# EAGLE design 5ChannelStepperDriver (EAGLE 6.3)
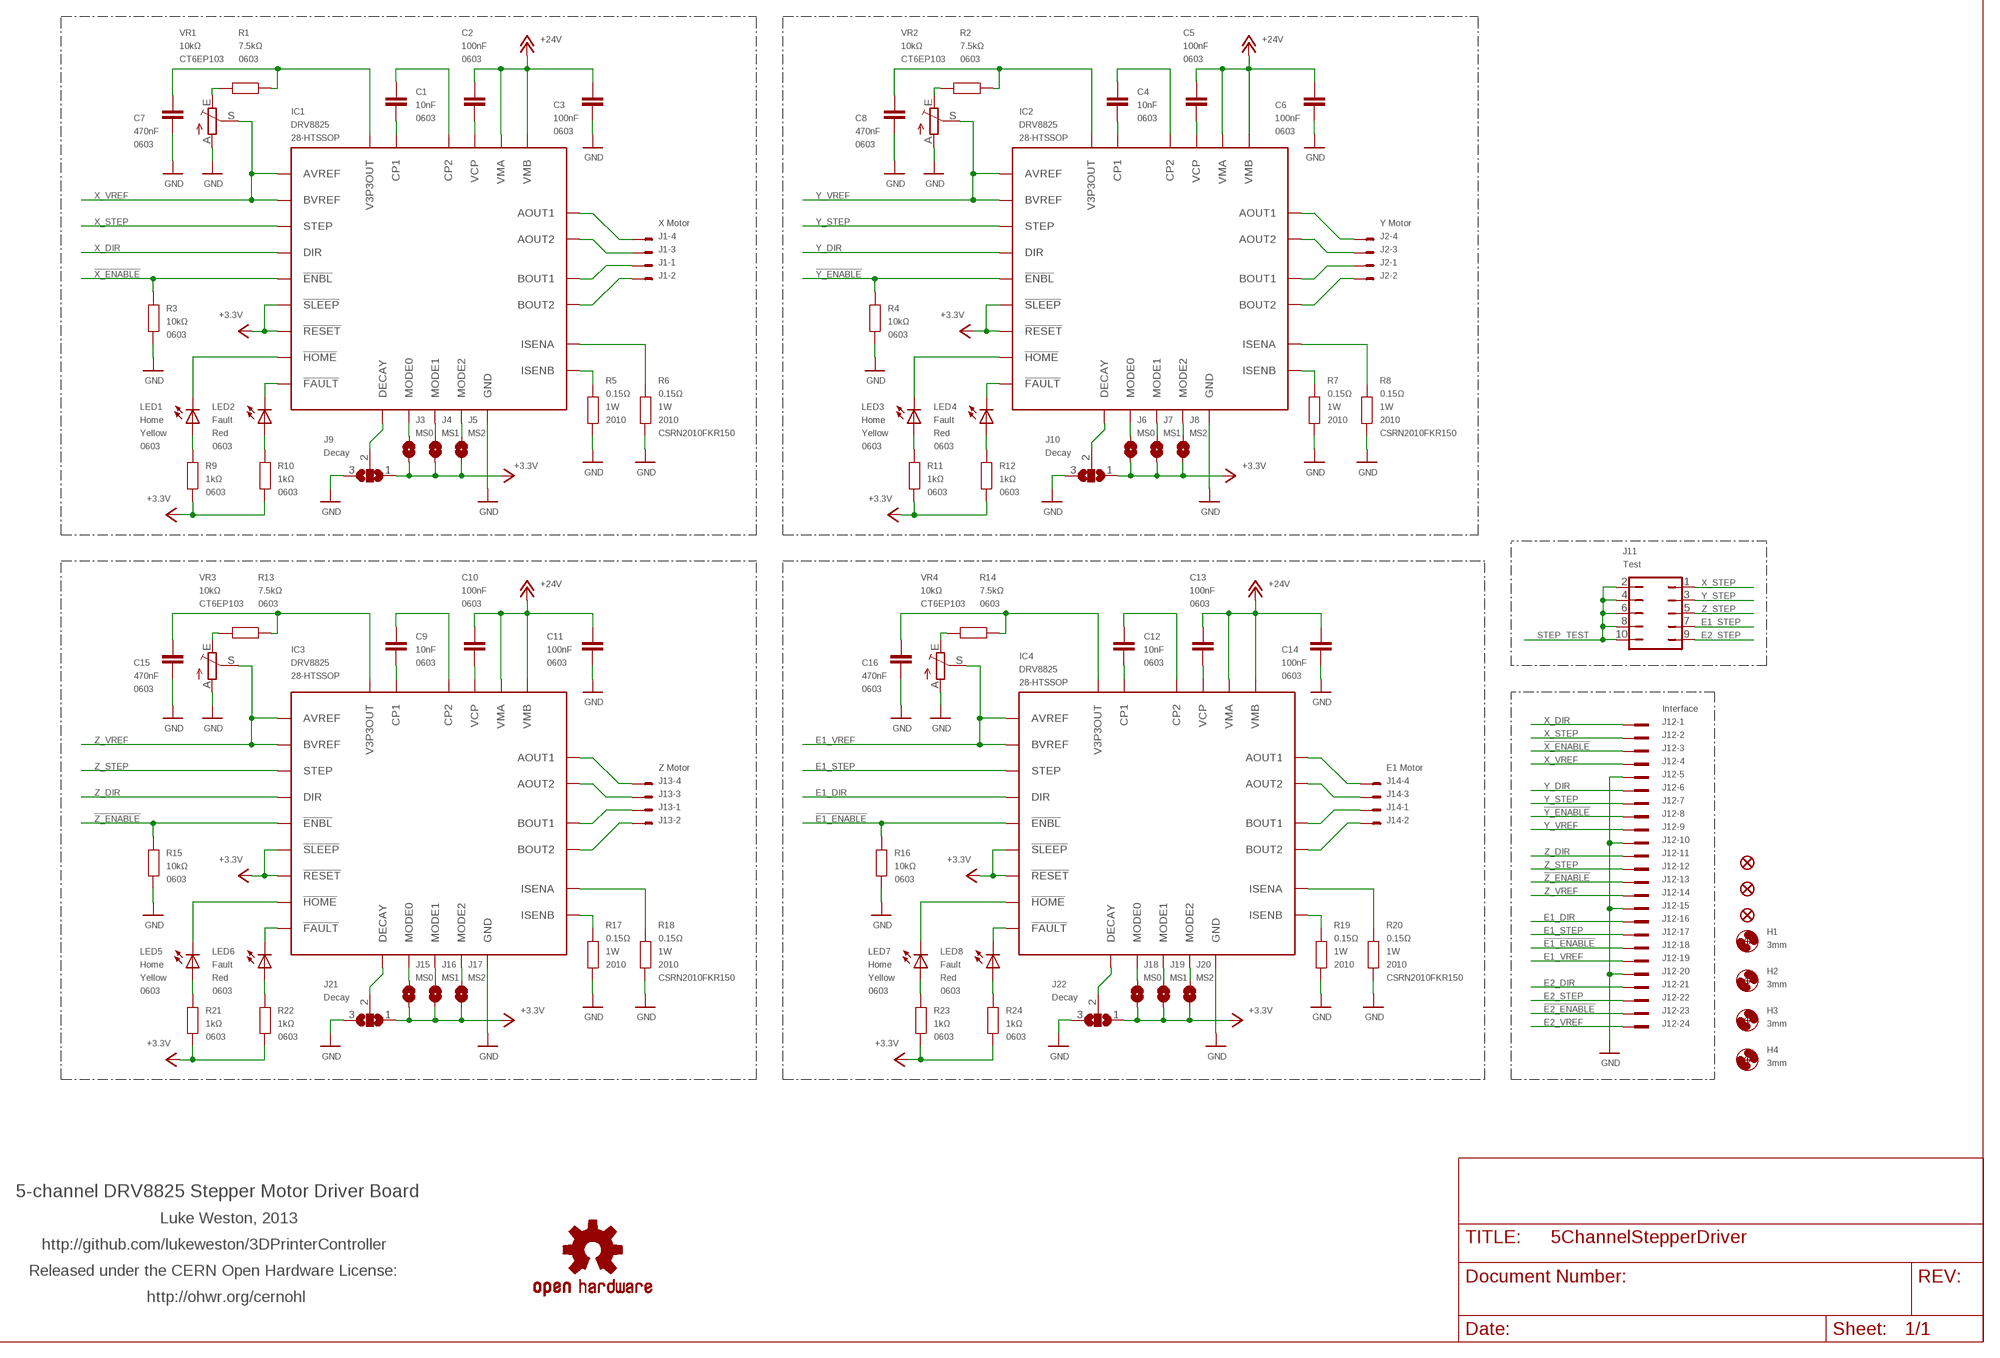
[diagram p0: schematic, sheet 1, part 1 of 3]
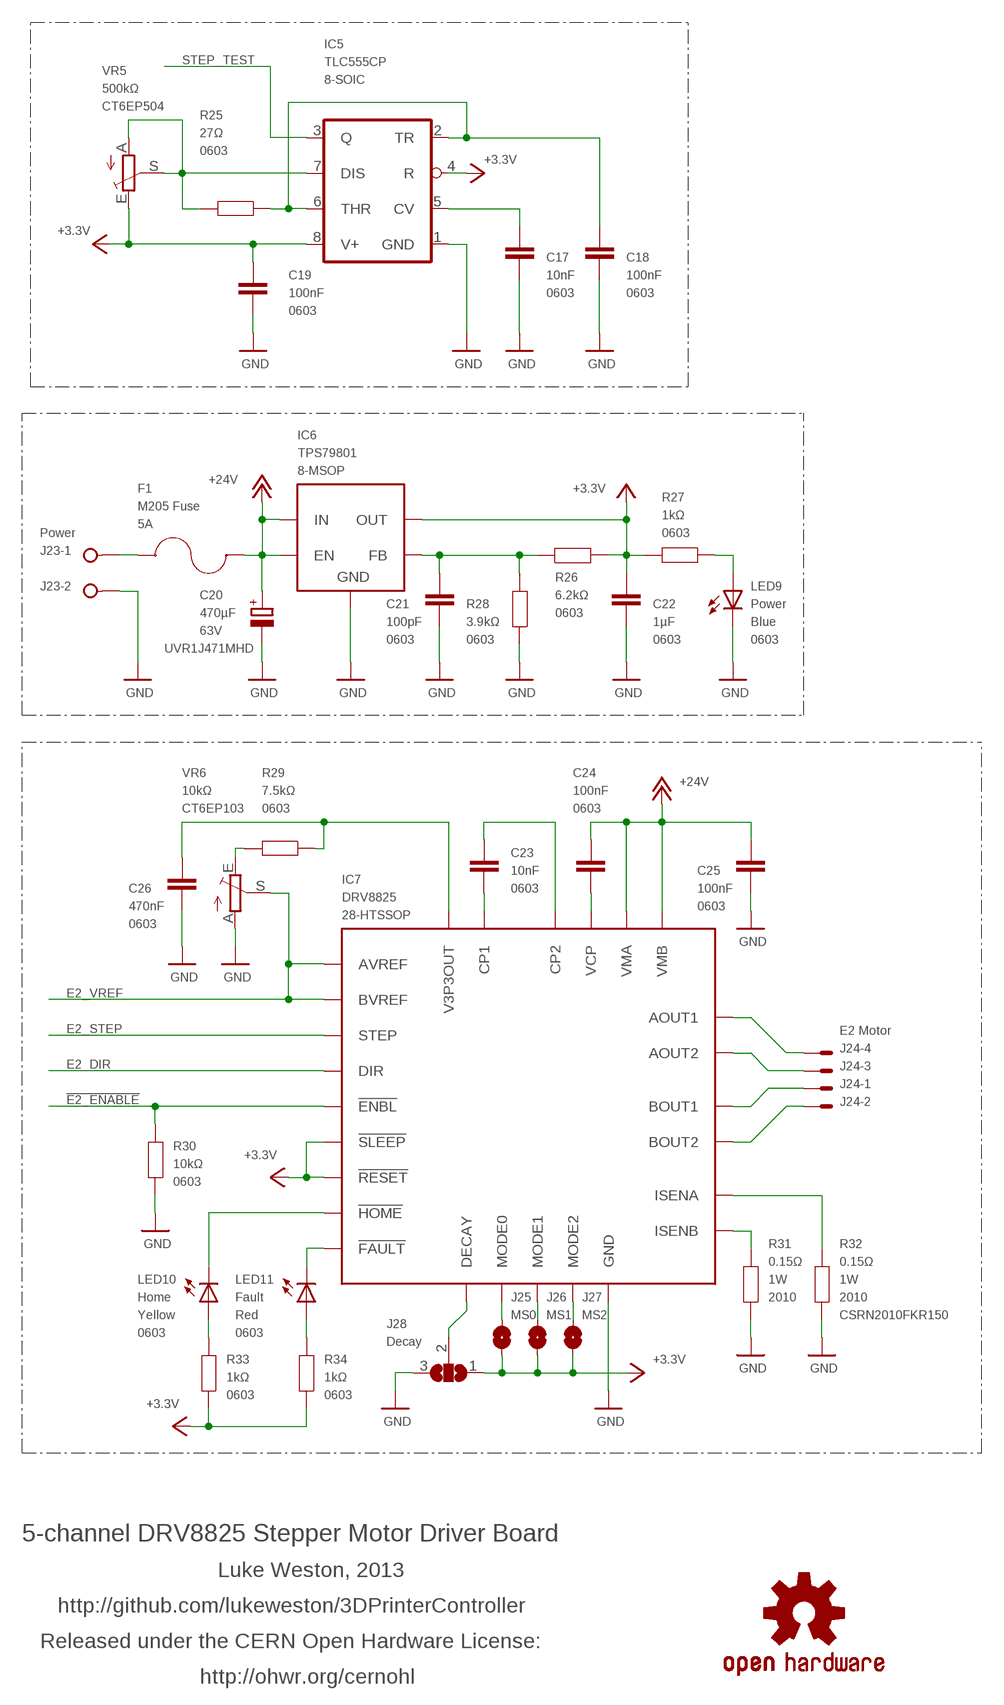
[diagram p1: schematic, sheet 1, part 2 of 3]
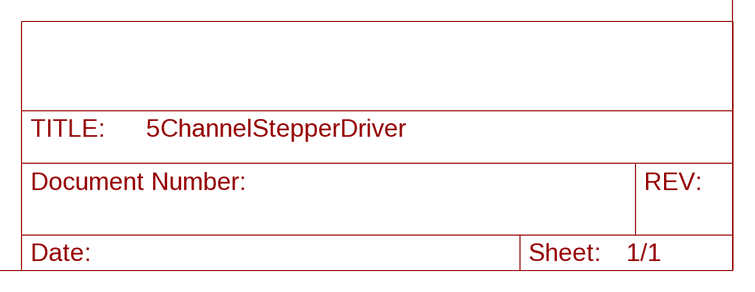
[diagram p2: schematic, sheet 1, part 3 of 3]

## Parts
C1  10nF  CAP0603  [0603]
C2  100nF  CAP0603  [0603]
C3  100nF  CAP0603  [0603]
C4  10nF  CAP0603  [0603]
C5  100nF  CAP0603  [0603]
C6  100nF  CAP0603  [0603]
C7  470nF  CAP0603  [0603]
C8  470nF  CAP0603  [0603]
C9  10nF  CAP0603  [0603]
C10  100nF  CAP0603  [0603]
C11  100nF  CAP0603  [0603]
C12  10nF  CAP0603  [0603]
C13  100nF  CAP0603  [0603]
C14  100nF  CAP0603  [0603]
C15  470nF  CAP0603  [0603]
C16  470nF  CAP0603  [0603]
C17  10nF  CAP0603  [0603]
C18  100nF  CAP0603  [0603]
C19  100nF  CAP0603  [0603]
C20  470µF  CPOL-EUE5-13  [E5-13]
C21  100pF  CAP0603  [0603]
C22  1µF  CAP0603  [0603]
C23  10nF  CAP0603  [0603]
C24  100nF  CAP0603  [0603]
C25  100nF  CAP0603  [0603]
C26  470nF  CAP0603  [0603]
F1  M205 Fuse  FUSE-M205  [FUSECLIP-FC211]
H1  3mm  MOUNT-HOLE3.0  [3,0]
H2  3mm  MOUNT-HOLE3.0  [3,0]
H3  3mm  MOUNT-HOLE3.0  [3,0]
H4  3mm  MOUNT-HOLE3.0  [3,0]
IC1  DRV8825  [R-PDSO-G28]
IC2  DRV8825  [R-PDSO-G28]
IC3  DRV8825  [R-PDSO-G28]
IC4  DRV8825  [R-PDSO-G28]
IC5  TLC555CP  LM555D  [SO08]
IC6  TPS79801  [R-PDSO-G8]
IC7  DRV8825  [R-PDSO-G28]
J1  X Motor  22-05-7048-04  [7395-04]
J2  Y Motor  22-05-7048-04  [7395-04]
J3  MS0  SJ  [SJ]
J4  MS1  SJ  [SJ]
J5  MS2  SJ  [SJ]
J6  MS0  SJ  [SJ]
J7  MS1  SJ  [SJ]
J8  MS2  SJ  [SJ]
J9  Decay  SJ2W  [SJ_2]
J10  Decay  SJ2W  [SJ_2]
J11  Test  JP5Q  [JP5Q]
J12  Interface  2524-  [PAK100/2500-24]
J13  Z Motor  22-05-7048-04  [7395-04]
J14  E1 Motor  22-05-7048-04  [7395-04]
J15  MS0  SJ  [SJ]
J16  MS1  SJ  [SJ]
J17  MS2  SJ  [SJ]
J18  MS0  SJ  [SJ]
J19  MS1  SJ  [SJ]
J20  MS2  SJ  [SJ]
J21  Decay  SJ2W  [SJ_2]
J22  Decay  SJ2W  [SJ_2]
J23  Power  W237-02P  [W237-132]
J24  E2 Motor  22-05-7048-04  [7395-04]
J25  MS0  SJ  [SJ]
J26  MS1  SJ  [SJ]
J27  MS2  SJ  [SJ]
J28  Decay  SJ2W  [SJ_2]
JP1  FIDUCIAL1X2  [FIDUCIAL-1X2]
JP2  FIDUCIAL1X2  [FIDUCIAL-1X2]
JP3  FIDUCIAL1X2  [FIDUCIAL-1X2]
LED1  Home  LED0603  [LED-0603]
LED2  Fault  LED0603  [LED-0603]
LED3  Home  LED0603  [LED-0603]
LED4  Fault  LED0603  [LED-0603]
LED5  Home  LED0603  [LED-0603]
LED6  Fault  LED0603  [LED-0603]
LED7  Home  LED0603  [LED-0603]
LED8  Fault  LED0603  [LED-0603]
LED9  Power  LED0603  [LED-0603]
LED10  Home  LED0603  [LED-0603]
LED11  Fault  LED0603  [LED-0603]
R1  7.5kΩ  RESISTOR0603  [0603]
R2  7.5kΩ  RESISTOR0603  [0603]
R3  10kΩ  RESISTOR0603  [0603]
R4  10kΩ  RESISTOR0603  [0603]
R5  0.15Ω  RESISTOR2010  [R2010]
R6  0.15Ω  RESISTOR2010  [R2010]
R7  0.15Ω  RESISTOR2010  [R2010]
R8  0.15Ω  RESISTOR2010  [R2010]
R9  1kΩ  RESISTOR0603  [0603]
R10  1kΩ  RESISTOR0603  [0603]
R11  1kΩ  RESISTOR0603  [0603]
R12  1kΩ  RESISTOR0603  [0603]
R13  7.5kΩ  RESISTOR0603  [0603]
R14  7.5kΩ  RESISTOR0603  [0603]
R15  10kΩ  RESISTOR0603  [0603]
R16  10kΩ  RESISTOR0603  [0603]
R17  0.15Ω  RESISTOR2010  [R2010]
R18  0.15Ω  RESISTOR2010  [R2010]
R19  0.15Ω  RESISTOR2010  [R2010]
R20  0.15Ω  RESISTOR2010  [R2010]
R21  1kΩ  RESISTOR0603  [0603]
R22  1kΩ  RESISTOR0603  [0603]
R23  1kΩ  RESISTOR0603  [0603]
R24  1kΩ  RESISTOR0603  [0603]
R25  27Ω  RESISTOR0603  [0603]
R26  6.2kΩ  RESISTOR0603  [0603]
R27  1kΩ  RESISTOR0603  [0603]
R28  3.9kΩ  RESISTOR0603  [0603]
R29  7.5kΩ  RESISTOR0603  [0603]
R30  10kΩ  RESISTOR0603  [0603]
R31  0.15Ω  RESISTOR2010  [R2010]
R32  0.15Ω  RESISTOR2010  [R2010]
R33  1kΩ  RESISTOR0603  [0603]
R34  1kΩ  RESISTOR0603  [0603]
SY1  OSHW-LOGOS  [OSHW-LOGO-S]
SY2  OSHW-LOGOS  [OSHW-LOGO-S]
VR1  10kΩ  TRIM_EU-CT6  [CT6]
VR2  10kΩ  TRIM_EU-CT6  [CT6]
VR3  10kΩ  TRIM_EU-CT6  [CT6]
VR4  10kΩ  TRIM_EU-CT6  [CT6]
VR5  500kΩ  TRIM_EU-CT6  [CT6]
VR6  10kΩ  TRIM_EU-CT6  [CT6]

## Nets
!E1_ENABLE: IC4.21(!ENBL) J12.18 R16.1
!E2_ENABLE: IC7.21(!ENBL) J12.23 R30.1
!X_ENABLE: IC1.21(!ENBL) J12.3 R3.1
!Y_ENABLE: IC2.21(!ENBL) J12.8 R4.1
!Z_ENABLE: IC3.21(!ENBL) J12.13 R15.1
+3V3: C19.1 C22.1 IC1.16(!RESET) IC1.17(!SLEEP) IC2.16(!RESET) IC2.17(!SLEEP) IC3.16(!RESET) IC3.17(!SLEEP) IC4.16(!RESET) IC4.17(!SLEEP) IC5.4(R) IC5.8(V+) IC6.1(OUT) IC7.16(!RESET) IC7.17(!SLEEP) J3.1 J4.1 J5.1 J6.1 J7.1 J8.1 J9.1 J10.1 J15.1 J16.1 J17.1 J18.1 J19.1 J20.1 J21.1 J22.1 J25.1 J26.1 J27.1 J28.1 R9.2 R10.2 R11.2 R12.2 R21.2 R22.2 R23.2 R24.2 R26.2 R27.2 R33.2 R34.2 VR5.E ; supply symbol labelled +3.3V
+24V: C2.1 C3.1 C5.1 C6.1 C10.1 C11.1 C13.1 C14.1 C20.+ C24.1 C25.1 F1.3 F1.4 IC1.4(VMA) IC1.11(VMB) IC2.4(VMA) IC2.11(VMB) IC3.4(VMA) IC3.11(VMB) IC4.4(VMA) IC4.11(VMB) IC6.5(EN) IC6.8(IN) IC7.4(VMA) IC7.11(VMB)
E1_DIR: IC4.20(DIR) J12.16
E1_STEP: IC4.22(STEP) J11.7 J12.17
E1_VREF: IC4.12(AVREF) IC4.13(BVREF) J12.19 VR4.S
E2_DIR: IC7.20(DIR) J12.21
E2_STEP: IC7.22(STEP) J11.9 J12.22
E2_VREF: IC7.12(AVREF) IC7.13(BVREF) J12.24 VR6.S
GND: C3.2 C6.2 C7.2 C8.2 C11.2 C14.2 C15.2 C16.2 C17.2 C18.2 C19.2 C20.- C21.2 C22.2 C25.2 C26.2 IC1.14(GND) IC1.28(GND) IC1.PAD(GND) IC2.14(GND) IC2.28(GND) IC2.PAD(GND) IC3.14(GND) IC3.28(GND) IC3.PAD(GND) IC4.14(GND) IC4.28(GND) IC4.PAD(GND) IC5.1(GND) IC6.4(GND) IC6.PAD(GND) IC7.14(GND) IC7.28(GND) IC7.PAD(GND) J9.3 J10.3 J12.5 J12.10 J12.15 J12.20 J21.3 J22.3 J23.2 J28.3 LED9.C R3.2 R4.2 R5.2 R6.2 R7.2 R8.2 R15.2 R16.2 R17.2 R18.2 R19.2 R20.2 R28.2 R30.2 R31.2 R32.2 VR1.A VR2.A VR3.A VR4.A VR6.A
N$3: IC1.5(AOUT1) J1.4
N$5: IC4.10(BOUT1) J14.1
N$6: IC3.10(BOUT1) J13.1
N$7: IC7.10(BOUT1) J24.1
N$8: IC7.7(AOUT2) J24.3
N$9: C7.1 IC1.15(V3P3OUT) R1.1
N$10: F1.1 F1.2 J23.1
N$11: R14.2 VR4.E
N$12: C8.1 IC2.15(V3P3OUT) R2.1
N$13: C16.1 IC4.15(V3P3OUT) R14.1
N$14: C26.1 IC7.15(V3P3OUT) R29.1
N$16: R2.2 VR2.E
N$17: R29.2 VR6.E
N$18: R1.2 VR1.E
N$19: C18.1 IC5.2(TR) IC5.6(THR) R25.1
N$20: C15.1 IC3.15(V3P3OUT) R13.1
N$21: C21.1 IC6.2(FB) R26.1 R28.1
N$22: R13.2 VR3.E
N$23: C17.1 IC5.5(CV)
N$24: LED9.A R27.1
N$26: IC5.7(DIS) R25.2 VR5.A VR5.S
N$28: IC1.7(AOUT2) J1.3
N$29: IC1.10(BOUT1) J1.1
N$35: IC1.8(BOUT2) J1.2
N$36: C1.2 IC1.1(CP1)
N$52: C1.1 IC1.2(CP2)
N$54: IC1.19(DECAY) J9.2
N$57: C2.2 IC1.3(VCP)
N$59: IC1.6(ISENA) R6.1
N$60: IC3.5(AOUT1) J13.4
N$61: IC1.9(ISENB) R5.1
N$62: IC3.7(AOUT2) J13.3
N$65: IC3.8(BOUT2) J13.2
N$67: IC1.18(!FAULT) LED2.C
N$68: IC1.27(!HOME) LED1.C
N$69: LED1.A R9.1
N$70: LED2.A R10.1
N$71: IC1.25(MODE1) J4.2
N$72: IC1.26(MODE2) J5.2
N$73: IC1.24(MODE0) J3.2
N$74: C10.2 IC3.3(VCP)
N$75: IC3.6(ISENA) R18.1
N$76: IC3.9(ISENB) R17.1
N$78: IC3.18(!FAULT) LED6.C
N$79: IC3.27(!HOME) LED5.C
N$80: LED5.A R21.1
N$81: LED6.A R22.1
N$82: C9.2 IC3.1(CP1)
N$83: C9.1 IC3.2(CP2)
N$84: IC3.19(DECAY) J21.2
N$85: IC3.24(MODE0) J15.2
N$86: IC3.25(MODE1) J16.2
N$87: IC3.26(MODE2) J17.2
N$91: IC2.5(AOUT1) J2.4
N$92: IC2.7(AOUT2) J2.3
N$93: IC2.10(BOUT1) J2.1
N$94: IC2.8(BOUT2) J2.2
N$95: C5.2 IC2.3(VCP)
N$96: IC2.6(ISENA) R8.1
N$97: IC2.9(ISENB) R7.1
N$99: IC2.18(!FAULT) LED4.C
N$100: IC2.27(!HOME) LED3.C
N$101: LED3.A R11.1
N$102: LED4.A R12.1
N$105: C4.2 IC2.1(CP1)
N$106: C4.1 IC2.2(CP2)
N$107: IC2.19(DECAY) J10.2
N$108: IC2.24(MODE0) J6.2
N$109: IC2.25(MODE1) J7.2
N$110: IC2.26(MODE2) J8.2
N$111: IC4.5(AOUT1) J14.4
N$112: IC4.7(AOUT2) J14.3
N$114: IC4.8(BOUT2) J14.2
N$115: C13.2 IC4.3(VCP)
N$116: IC4.6(ISENA) R20.1
N$117: IC4.9(ISENB) R19.1
N$119: IC4.18(!FAULT) LED8.C
N$120: IC4.27(!HOME) LED7.C
N$121: LED7.A R23.1
N$122: LED8.A R24.1
N$123: C12.2 IC4.1(CP1)
N$124: C12.1 IC4.2(CP2)
N$125: IC4.19(DECAY) J22.2
N$126: IC4.24(MODE0) J18.2
N$127: IC4.25(MODE1) J19.2
N$128: IC4.26(MODE2) J20.2
N$165: IC7.5(AOUT1) J24.4
N$168: IC7.8(BOUT2) J24.2
N$169: C24.2 IC7.3(VCP)
N$170: IC7.6(ISENA) R32.1
N$171: IC7.9(ISENB) R31.1
N$173: IC7.18(!FAULT) LED11.C
N$174: IC7.27(!HOME) LED10.C
N$175: LED10.A R33.1
N$176: LED11.A R34.1
N$177: C23.2 IC7.1(CP1)
N$178: C23.1 IC7.2(CP2)
N$179: IC7.19(DECAY) J28.2
N$180: IC7.24(MODE0) J25.2
N$181: IC7.25(MODE1) J26.2
N$182: IC7.26(MODE2) J27.2
STEP_TEST: IC5.3(Q) J11.2 J11.4 J11.6 J11.8 J11.10
X_DIR: IC1.20(DIR) J12.1
X_STEP: IC1.22(STEP) J11.1 J12.2
X_VREF: IC1.12(AVREF) IC1.13(BVREF) J12.4 VR1.S
Y_DIR: IC2.20(DIR) J12.6
Y_STEP: IC2.22(STEP) J11.3 J12.7
Y_VREF: IC2.12(AVREF) IC2.13(BVREF) J12.9 VR2.S
Z_DIR: IC3.20(DIR) J12.11
Z_STEP: IC3.22(STEP) J11.5 J12.12
Z_VREF: IC3.12(AVREF) IC3.13(BVREF) J12.14 VR3.S

## Notes on the sheet
- 5-channel DRV8825 Stepper Motor Driver Board
- Luke Weston, 2013
- http://github.com/lukeweston/3DPrinterController
- Released under the CERN Open Hardware License:
- http://ohwr.org/cernohl
- 5-channel DRV8825 Stepper Motor Driver Board
- Luke Weston, 2013
- http://github.com/lukeweston/3DPrinterController
- Released under the CERN Open Hardware License:
- http://ohwr.org/cernohl

## Library data of the parts
C1-C19 C21-C26 = freetronics-master-v1:CAP: Capacitor Standard 0603 ceramic capacitor, and 0.1" leaded capacitor.; PACKAGE: 0603
C20 = rcl:CPOL-EU: POLARIZED CAPACITOR, European symbol; SKU: UVR1J471MHD; VOLTAGE: 63V
F1 = freetronics-luke:FUSE-M205: PC-mount M205 fuse clips; VALUE2: 5A
H1-H4 = holes:MOUNT-HOLE: MOUNTING HOLE with drill center marker
IC1-IC4 IC7 = freetronics-luke:DRV8825: Texas Instruments DRV8825 bipolar stepper motor driver; PACKAGE: 28-HTSSOP
IC5 = linear:*555: TIMER; PACKAGE: 8-SOIC
IC6 = freetronics-luke:TPS79801: TI TPS79801 high-Vin, 50mA LDO; PACKAGE: 8-MSOP
J1 J2 J13 J14 J24 = con-molex:22-?-04: CONNECTOR wire to board 2.54 mm (.1 inch) pitch header; OC_FARNELL: unknown; OC_NEWARK: unknown
J3-J8 J15-J20 J25-J27 = freetronics-luke:SJ: PCB "solder jumper". Note that there should nothing on the BOM corresponding to this "component".
J9 J10 J21 J22 J28 = freetronics-master-v1:SJ2W: SMD solder JUMPER
J11 = jumper:JP5Q: JUMPER
J12 = con-3m:2524-: 3M (TM) Pak 100 4-Wall Header Source: 3M; OC_FARNELL: unknown; OC_NEWARK: unknown
J23 = con-wago-508:W237-02P: WAGO SREW CLAMP; OC_FARNELL: unknown; OC_NEWARK: unknown
JP1-JP3 = SparkFun:FIDUCIAL: Fiducial Alignment Points Various fiducial points for machine vision alignment.
LED1 LED3 LED5 LED7 LED10 = freetronics-master-v1:LED: LEDs Standard schematic elements and footprints for 5mm, 3mm, 1206, and 0603 sized LEDs. 5mm - Spark Fun Electronics SKU : COM-00529 (and others); COLOR: Yellow; PACKAGE: 0603
LED2 LED4 LED6 LED8 LED11 = freetronics-master-v1:LED: LEDs Standard schematic elements and footprints for 5mm, 3mm, 1206, and 0603 sized LEDs. 5mm - Spark Fun Electronics SKU : COM-00529 (and others); COLOR: Red; PACKAGE: 0603
LED9 = freetronics-master-v1:LED: LEDs Standard schematic elements and footprints for 5mm, 3mm, 1206, and 0603 sized LEDs. 5mm - Spark Fun Electronics SKU : COM-00529 (and others); COLOR: Blue; PACKAGE: 0603
R1-R4 R9-R16 R21-R30 R33 R34 = freetronics-master-v1:RESISTOR: Resistor Basic schematic elements and footprints for 0603, 1206, and PTH 1/10th watt (small) resistors.; PACKAGE: 0603
R5-R8 R17-R20 R31 R32 = freetronics-master-v1:RESISTOR: Resistor Basic schematic elements and footprints for 0603, 1206, and PTH 1/10th watt (small) resistors.; ID: CSRN2010FKR150; PACKAGE: 2010; POWER: 1W
SY1 SY2 = SparkFun:OSHW-LOGO: Open Source Hardware Logo This logo indicates the piece of hardware it is found on incorporates a OSHW license and/or adheres to the definition of open source hardware found here: http://freedomdefined.org/OSHW
VR1-VR4 VR6 = pot:TRIM_EU-: POTENTIOMETER; ID: CT6EP103
VR5 = pot:TRIM_EU-: POTENTIOMETER; ID: CT6EP504

## Board
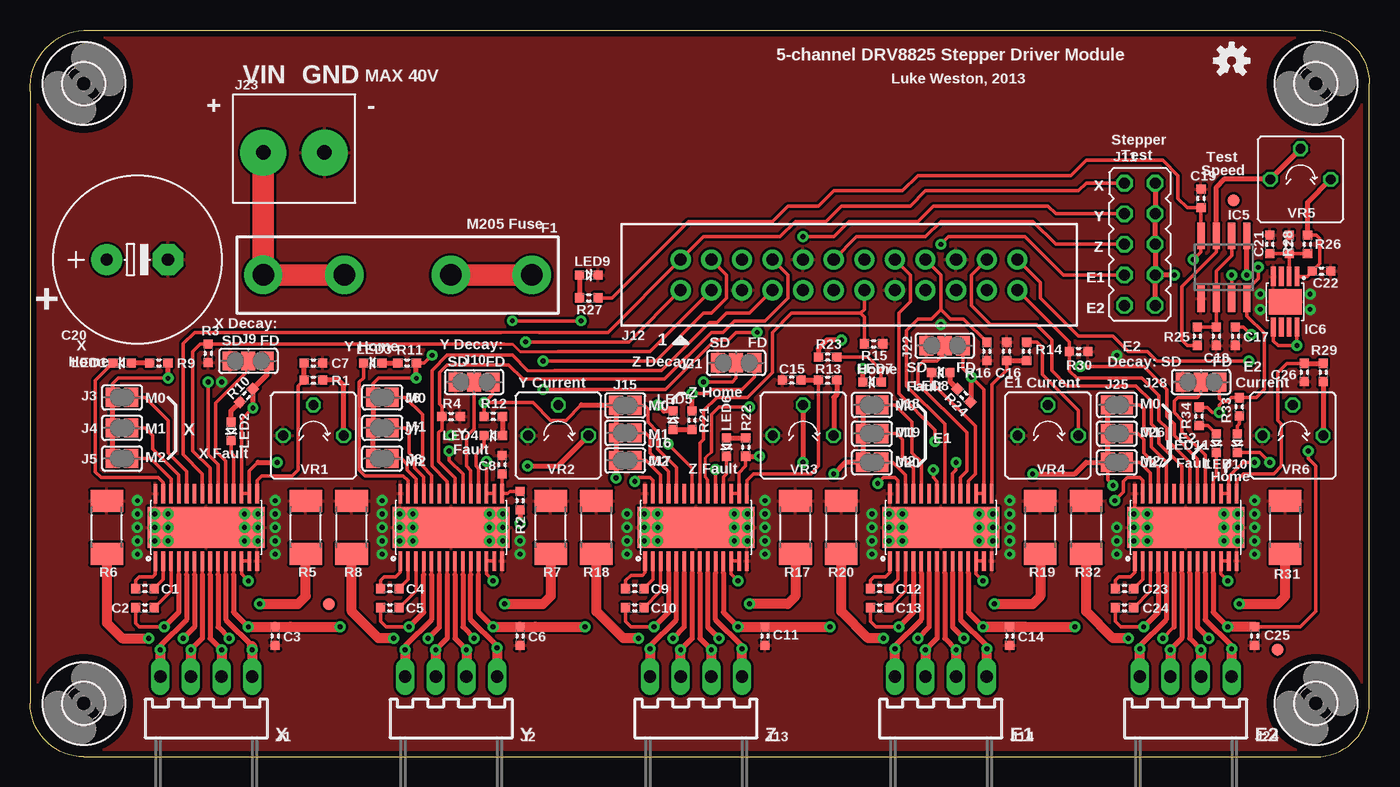
[diagram p3: board, top side]
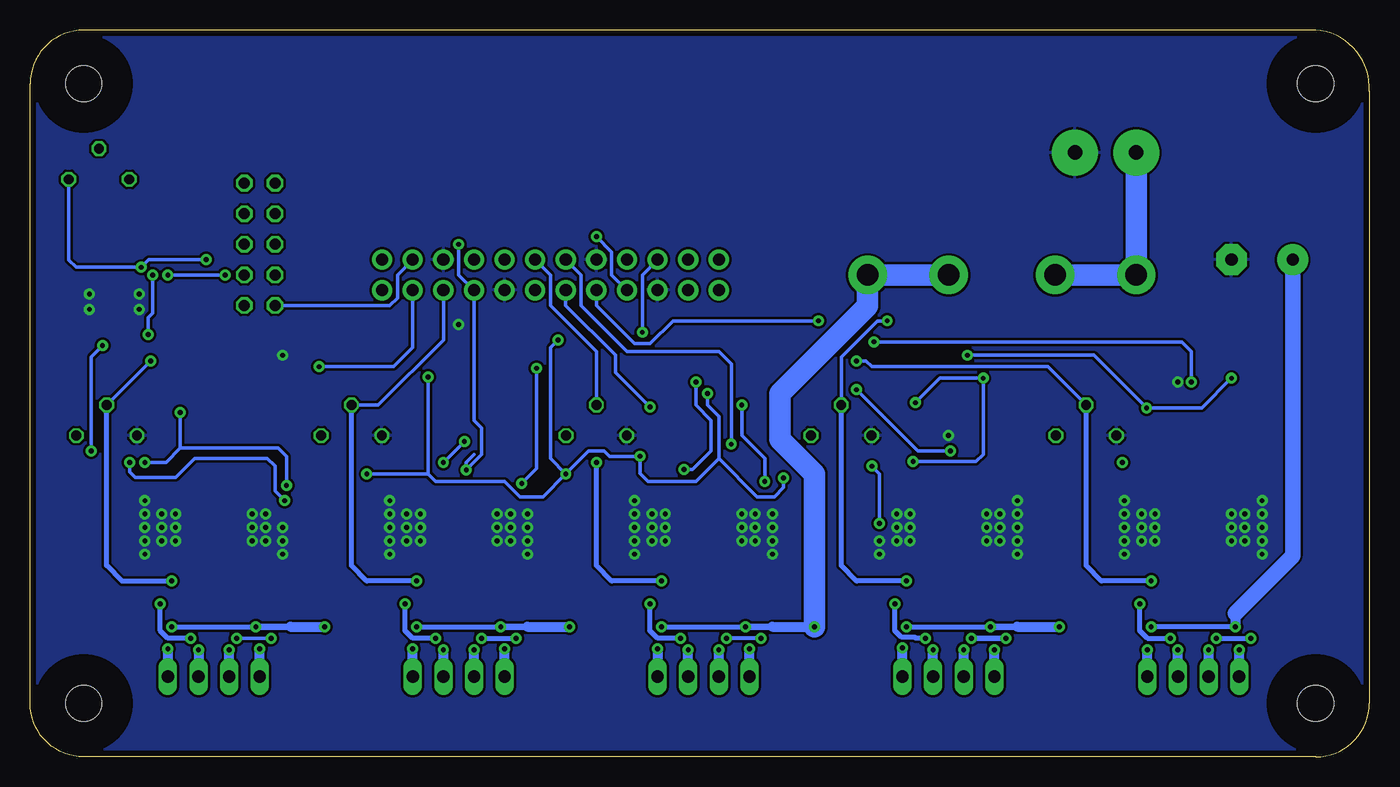
[diagram p4: board, bottom side, seen from below]

Size 111.13 x 60.32 mm. Coordinates in mm from the lower left corner, seen from the top.
Outline: 4.45,0 106.69,0 arc90 111.13,4.45 111.13,55.88 arc90 106.69,60.32 4.45,60.32 arc90 0.01,55.24 0.01,4.45 arc90 4.45,0
Copper layers (1*16): Top 0.035mm / dielectric 1.5mm / Bottom 0.035mm
Design rules "PCBCart-Standard *": minimum track width 8mil, minimum drill 0.4mm, track to track 8mil, track to pad 8mil, pad to pad 8mil, via to via 8mil, smd to smd 8mil, copper to edge 20mil, drill to drill 8mil, minimum pad ring 8mil, minimum via ring 10mil, stop-mask expansion 3mil, vias tented up to drill 16mil, thermal gap 8mil

### Footprints (pad centres in the part's own frame; a part is rotated, then mirrored left to right if it is on the bottom)
0603 = smd 0.762 x 0.762: 1 -0.762,0; 2 0.762,0
E5-13 = drill 1.016 pad 2.54: + -2.54,0 | drill 1.016 pad 2.54 octagon: - 2.54,0
FUSECLIP-FC211 = drill 1.778 pad 3.175: 1 -11.143,0; 2 -4.412,0; 3 4.412,0; 4 11.143,0
3,0 = hole 3: 0,0
R-PDSO-G28 = smd 0.3 x 1.6: 1 -4.225,-2.8; 2 -3.575,-2.8; 3 -2.925,-2.8; 4 -2.275,-2.8; 5 -1.625,-2.8; 6 -0.975,-2.8; 7 -0.325,-2.8; 8 0.325,-2.8; 9 0.975,-2.8; 10 1.625,-2.8; 11 2.275,-2.8; 12 2.925,-2.8; 13 3.575,-2.8; 14 4.225,-2.8; 15 4.225,2.8; 16 3.575,2.8; 17 2.925,2.8; 18 2.275,2.8; 19 1.625,2.8; 20 0.975,2.8; 21 0.325,2.8; 22 -0.325,2.8; 23 -0.975,2.8; 24 -1.625,2.8; 25 -2.275,2.8; 26 -2.925,2.8; 27 -3.575,2.8; 28 -4.225,2.8 | smd 9.7 x 3.4: PAD 0,0
SO08 = smd 0.6 x 2.2: 1 -1.905,-2.6; 2 -0.635,-2.6; 3 0.635,-2.6; 4 1.905,-2.6; 5 1.905,2.6; 6 0.635,2.6; 7 -0.635,2.6; 8 -1.905,2.6
R-PDSO-G8 = smd 0.4 x 1.6: 1 -0.975,-2.1; 2 -0.325,-2.1; 3 0.325,-2.1; 4 0.975,-2.1; 5 0.975,2.1; 6 0.325,2.1; 7 -0.325,2.1; 8 -0.975,2.1 | smd 2.75 x 2.1: PAD 0,0
7395-04 = drill 1.016 long: 1 3.81,0; 2 1.27,0; 3 -1.27,0; 4 -3.81,0
SJ = smd 1.168 x 1.6: 1 -0.762,0; 2 0.762,0
SJ_2 = smd 1.168 x 1.6: 1 -1.524,0; 2 0,0; 3 1.524,0
JP5Q = drill 0.914 octagon: 1 -5.08,-1.27; 2 -5.08,1.27; 3 -2.54,-1.27; 4 -2.54,1.27; 5 0,-1.27; 6 0,1.27; 7 2.54,-1.27; 8 2.54,1.27; 9 5.08,-1.27; 10 5.08,1.27
PAK100/2500-24 = drill 1 pad 1.676: 1 -13.97,-1.27; 2 -13.97,1.27; 3 -11.43,-1.27; 4 -11.43,1.27; 5 -8.89,-1.27; 6 -8.89,1.27; 7 -6.35,-1.27; 8 -6.35,1.27; 9 -3.81,-1.27; 10 -3.81,1.27; 11 -1.27,-1.27; 12 -1.27,1.27; 13 1.27,-1.27; 14 1.27,1.27; 15 3.81,-1.27; 16 3.81,1.27; 17 6.35,-1.27; 18 6.35,1.27; 19 8.89,-1.27; 20 8.89,1.27; 21 11.43,-1.27; 22 11.43,1.27; 23 13.97,-1.27; 24 13.97,1.27
W237-132 = drill 1.194 pad 3.81: 1 -2.54,-0.635; 2 2.54,-0.635
FIDUCIAL-1X2 = smd 1 x 1: 1 0,0
LED-0603 = smd 0.762 x 0.762: A -0.762,0; C 0.762,0
R2010 = smd 1.8 x 2.7: 1 -2.2,0; 2 2.2,0
CT6 = drill 0.813 octagon: A -2.515,0; E 2.515,0; S 0,2.54

### Placement (x,y rotation side)
C1  9.53,13.97 180 top
C2  9.53,12.38 0 top
C3  20.33,10.03 270 top
C4  29.85,13.97 180 top
C5  29.85,12.38 0 top
C6  40.65,10.03 270 top
C7  23.5,32.7 0 top
C8  39.16,24.26 90 top
C9  50.17,13.97 180 top
C10  50.17,12.38 0 top
C11  60.97,10.03 270 top
C12  70.49,13.97 180 top
C13  70.49,12.38 0 top
C14  81.29,10.03 270 top
C15  63.19,31.27 180 top
C16  81.03,33.66 90 top
C17  100.02,34.92 270 top
C18  98.43,34.92 270 top
C19  97.16,46.35 90 top
C20  8.9,41.27 0 top
C21  102.88,42.54 90 top
C22  107.17,40.32 0 top
C23  90.81,13.97 180 top
C24  90.81,12.38 0 top
C25  101.61,10.03 270 top
C26  105.74,31.91 270 top
F1  30.49,40 0 top
H1  106.69,55.88 0 top
H2  4.45,55.88 0 top
H3  106.69,4.45 0 top
H4  4.45,4.45 0 top
IC1  14.61,19.05 0 top
IC2  34.93,19.05 0 top
IC3  55.25,19.05 0 top
IC4  75.57,19.05 0 top
IC5  99.07,40.64 0 top
IC6  104.15,37.78 180 top
IC7  95.89,19.05 0 top
J1  14.61,6.67 0 top
J2  34.93,6.67 0 top
J3  7.63,29.85 0 top
J4  7.63,27.31 0 top
J5  7.63,24.77 0 top
J6  29.22,29.85 0 top
J7  29.22,27.31 0 top
J8  29.22,24.77 0 top
J9  18.11,32.86 180 top
J10  36.84,31.12 180 top
J11  92.08,42.54 270 top
J12  67.95,40 0 top
J13  55.25,6.67 0 top
J14  75.57,6.67 0 top
J15  49.38,29.18 0 top
J16  49.38,26.89 0 top
J17  49.38,24.61 0 top
J18  69.86,29.21 0 top
J19  69.86,26.83 0 top
J20  69.86,24.45 0 top
J21  58.59,32.7 180 top
J22  75.89,34.13 180 top
J23  21.89,50.8 0 top
J24  95.89,6.67 0 top
J25  90.18,29.21 0 top
J26  90.18,26.83 0 top
J27  90.18,24.45 0 top
J28  97.16,31.12 180 top
JP1  103.51,8.89 0 top
JP2  99.86,46.2 0 top
JP3  24.77,12.7 0 top
LED1  7.63,32.7 180 top
LED2  16.68,27.02 270 top
LED3  28.43,32.7 180 top
LED4  38.43,26.67 180 top
LED5  53.35,27.94 90 top
LED6  57.79,25.72 270 top
LED7  69.86,31.12 180 top
LED8  75.57,31.91 180 top
LED9  46.36,40 0 top
LED10  100.18,26.04 270 top
LED11  98.43,26.04 270 top
R1  23.5,31.27 0 top
R2  40.65,21.27 270 top
R3  14.77,33.5 270 top
R4  34.93,28.26 0 top
R5  22.87,19.05 90 top
R6  6.36,19.05 90 top
R7  43.19,19.05 90 top
R8  26.68,19.05 90 top
R9  10.68,32.7 0 top
R10  17.95,30 45 top
R11  31.28,32.7 0 top
R12  38.43,28.26 180 top
R13  66.18,31.27 0 top
R14  82.69,33.66 90 top
R15  69.99,34.29 0 top
R16  79.38,33.66 270 top
R17  63.51,19.05 90 top
R18  47,19.05 90 top
R19  83.83,19.05 90 top
R20  67.32,19.05 90 top
R21  54.94,27.94 90 top
R22  59.38,25.72 270 top
R23  66.18,33.18 180 top
R24  77.48,30 315 top
R25  96.85,34.92 270 top
R26  106,42.54 90 top
R27  46.36,38.1 0 top
R28  104.48,42.54 90 top
R29  107.3,31.91 270 top
R30  87,33.66 0 top
R31  104.15,19.05 90 top
R32  87.64,19.05 90 top
R33  100.34,29.05 90 top
R34  97.01,28.26 90 top
SY1  99.7,57.78 0 top
SY2  99.7,57.78 0 top
VR1  23.5,26.67 0 top
VR2  43.82,26.67 0 top
VR3  64.14,26.67 0 top
VR4  84.46,26.67 0 top
VR5  105.42,47.94 0 top
VR6  104.78,26.67 0 top

### Tracks (layer width: path | path; a pad name or v marks a point on that pad's centre or on a via)
!E1_ENABLE
  Top 0.279: IC4.21 75.9,27.62 72.72,30.8 72.72,35.4 73.67,36.35 74.78,36.35 75.57,37.15 | 75.57,37.15 75.57,40 J12.18 | R16.1 77.45,36.35 76.37,36.35 75.57,37.15
!E2_ENABLE
  Top 0.279: IC7.21 96.22,24.44 94.31,26.35 94.31,27.31 93.67,27.94 93.67,30 92.24,31.43 86.84,31.43 86.24,32.04 R30.1 86.24,34.42 J12.23
!X_ENABLE
  Top 0.254: 43.82,33.66 40.65,33.66 40.05,34.26 39.35,34.26
  Top 0.279: 13.5,27.91 13.5,33.66 14.11,34.26 R3.1
  Top 0.305: IC1.21 14.94,23.96 13.5,25.4 13.5,27.91 | J12.3 51.44,33.66 43.82,33.66 | R3.1 39.35,34.26
!Y_ENABLE
  Top 0.279: 40.89,31.35 39.7,32.54 34.62,32.54 33.98,31.91 33.98,29.27 34.17,29.08 R4.1 34.17,27.18 33.9,26.91 33.9,24.53
  Top 0.305: IC2.21 35.26,23.17 33.9,24.53 | 40.89,31.35 52.63,31.35 56.52,35.24 57.48,35.24 58.43,36.2 60.97,36.2 62.87,38.1 62.87,40 J12.8
!Z_ENABLE
  Top 0.279: IC3.21 55.58,26.04 55.89,26.35 55.89,28.73 57,29.85 59.54,29.85 61.6,31.91 61.6,35.24 63.19,36.83 68.91,36.83 | R15.1 69.22,36.51 68.91,36.83 | J12.13 69.22,37.15 68.91,36.83
+3V3  (via drill 0.4)
  Top 0.279: J3.1 6.87,30.99 7.31,31.43 v11.44,31.43 | v18.49,28.96 17.54,28.01 IC1.17 IC1.16 18.19,23.74 18.9,24.45 | J6.1 28.46,30.99 28.9,31.43 v32.04,31.43 | IC2.17 v37.86,24.52 | J10.1 38.36,30.1 v37.66,29.4 | R11.2 32.71,32.7 v33.35,33.34 | IC6.1 105.96,39.88 C22.1 107.01,40.93 107.01,43.02 106.72,43.31 R26.2 | v37.66,29.4 41.73,29.4 43.19,27.94 44.46,27.94 45.73,29.21 | 48.59,29.21 J15.1 | R12.2 v37.66,29.4 | J21.1 60.11,31.53 59.06,30.48 56.52,30.48 56.21,30.16 v54.94,30.16 | IC3.16 58.83,23.58 59.38,24.13 R22.2 | J22.1 77.41,32.23 v78.11,31.53 79.15,30.49 IC4.16 | R24.2 | R24.2 78.11,29.37 | IC7.17 IC7.16 99.47,23.26 100.66,24.45 v101.61,24.45 | v89.86,22.54 89.42,22.99 J27.1 | R34.2 97.67,29.02 98.12,28.58 v98.69,28.58 98.69,29.21 98.96,29.48 | J28.1 98.69,29.75 98.96,29.48 | 98.96,29.48 99.34,29.48 99.67,29.81 R33.2 101.74,29.81 102.4,30.48 102.4,35.16 100.97,36.59 IC5.4 100.97,38.73 101.93,39.69 v101.93,40.64 | v96.53,41.27 97.16,41.91 IC5.8 C19.1 96.02,45.59 95.26,46.35 95.26,48.26 93.99,49.53 87.64,49.53 86.37,48.26 73.67,48.26 72.4,46.99 66.68,46.99 65.41,45.72 62.87,45.72 61.6,44.45 54.62,44.45 48.27,38.1 R27.2
  Top 0.305: IC2.17 IC2.16 | IC3.17 IC3.16 | IC4.17 IC4.16
  Top 0.406: J6.1 J7.1 J8.1 | J5.1 J4.1 J3.1 | v11.44,31.43 R9.2 | J9.1 19.63,31.69 R10.2 v18.49,28.96 | 18.9,24.45 v20.49,24.45 | v32.04,31.43 R11.2 | J15.1 J16.1 J17.1 v48.62,23.15 | 45.73,29.21 48.59,29.21 | R21.2 v54.94,30.16 | R22.2 v60.52,24.96 | J18.1 J19.1 J20.1 67.64,24.45 v66.68,23.5 | v83.19,23.5 86.69,23.5 87.64,24.45 J27.1 J26.1 J25.1 | 78.11,29.37 v78.11,31.53 | R26.2 106,46.01 VR5.E | v67.32,34.61 66.13,34.61 65.41,33.89 R23.2
  Bottom 0.279: v11.44,31.43 13.92,28.96 v18.49,28.96 22.87,33.34 v33.35,33.34 | v37.66,29.4 35.63,31.43 v32.04,31.43 32.04,25.11 32.64,24.52 v37.86,24.52 | 53.98,24.77 50.81,21.59 49.38,21.59 48.62,22.35 v48.62,23.15 | 53.98,24.77 55.89,22.86 59.86,22.86 60.52,23.53 v60.52,24.96 63.06,24.96 63.51,25.4 64.78,25.4 v66.68,23.5 | v66.68,23.5 67.95,24.77 67.95,33.97 v67.32,34.61 | v66.68,23.5 68.59,21.59 70.49,21.59 71.76,22.86 77.48,22.86 78.11,23.5 | v83.19,23.5 78.11,23.5 | 78.11,23.5 v78.11,31.53 | v101.61,24.45 99.86,24.45 98.69,25.62 | v98.69,28.58 98.69,25.62 | v96.53,41.27 101.29,41.27 v101.93,40.64 107.32,40.64 107.93,41.25 VR5.E | 98.69,25.62 90.56,25.62 89.86,24.92 v89.86,22.54 | 53.98,24.77 53.98,28.26 54.94,29.21 v54.94,30.16
+24V  (via drill 0.4)
  Top 0.279: IC3.11 57.53,15.29 | IC3.4 52.98,15.29 | 106.69,24.13 106.05,24.77 v106.05,25.4
  Top 0.305: IC2.4 32.66,15.13 | IC2.11 37.21,15.13 | IC1.4 12.34,15.13 | IC1.11 16.89,15.13 | IC4.4 73.3,15.29 | IC4.11 77.85,15.29 | IC7.4 93.62,15.29 | IC7.11 98.17,15.29 | v31.44,10.79 29.54,10.79 29.09,11.24 C5.1 | v11.12,10.79 9.06,10.79 8.77,11.08 C2.1 | v51.76,10.79 49.86,10.79 49.41,11.24 C10.1 | C13.1 69.73,11.24 70.18,10.79 v72.08,10.79 | C24.1 90.05,11.24 90.5,10.79 v92.4,10.79 | IC6.5 103.17,34.53 103.57,34.13 v105.12,34.13 IC6.8 | 106.69,24.13 106.69,12.06 105.42,10.79 C25.1
  Top 0.406: v11.12,10.79 12.34,12.01 12.34,15.13 | v18.11,10.79 16.89,12.01 16.89,15.13 | v38.43,10.8 v38.43,10.79 37.21,12.01 37.21,15.13 | v31.44,10.79 32.66,12.01 32.66,15.13 | 57.53,15.29 57.53,12.01 v58.75,10.79 | 52.98,15.29 52.98,12.01 v51.76,10.79 | 77.85,15.29 77.85,12.01 v79.07,10.79 | 73.3,15.29 73.3,12.01 v72.08,10.79 | 93.62,15.29 93.62,12.01 v92.4,10.79 | 98.17,15.29 98.17,12.01 v99.39,10.79
  Top 0.508: 24.14,10.8 C3.1
  Top 0.61: 44.46,10.8 C6.1 | v58.75,10.8 v58.75,10.79 | 62.24,10.79 C11.1 v66.37,10.79 | v99.39,10.8 v99.39,10.79 | v86.69,10.79 82.56,10.79 C14.1
  Top 0.813: v18.11,10.79 C3.1 | C3.1 21.6,10.79 | v38.43,10.79 C6.1 | C6.1 41.92,10.79 | C3.1 v25.73,10.79 | C6.1 v46.05,10.79 | v58.75,10.79 v66.37,10.79 | 82.56,10.79 v79.07,10.79 v86.69,10.79 | C25.1 v99.39,10.79
  Top 1.778: F1.4 F1.3
  Bottom 0.279: v106.05,25.4 106.05,33.2 v105.12,34.13
  Bottom 0.406: v11.12,10.79 v18.11,10.79 | v38.43,10.79 v31.44,10.79 | v58.75,10.79 v51.76,10.79 | v79.07,10.79 v72.08,10.79 | v99.39,10.79 v92.4,10.79
  Bottom 0.559: v31.44,10.79 29.22,10.79 | v51.76,10.79 49.54,10.79 | v72.08,10.79 69.86,10.79 | v92.4,10.79 89.54,10.79
  Bottom 0.813: 11.12,11.91 v11.12,10.79 | 29.22,10.79 v25.73,10.79 | 49.54,10.79 v46.05,10.79 | 69.86,10.79 v66.37,10.79 | 89.54,10.79 v86.69,10.79
  Bottom 1.27: C20.+ 6.36,16.67 11.12,11.91
  Bottom 1.778: v46.05,10.79 46.05,23.5 48.9,26.35 48.9,30.16 41.63,37.43 F1.4
E1_DIR  (via drill 0.4)
  Top 0.279: IC4.20 76.55,23.52 76.84,23.81 v76.84,24.45 | J12.16 73.03,40 73.03,37.78 72.08,36.83 72.08,30.16 75.1,27.15 v75.1,26.19
  Bottom 0.279: v76.84,24.45 v75.1,26.19
E1_STEP  (via drill 0.4)
  Top 0.279: v74.94,23.81 74.94,23.18 75.26,22.86 75.26,21.86 IC4.22 | v75.57,42.54 76.21,43.18 82.56,43.18 85.73,40 J11.7
  Bottom 0.279: 74.3,25.08 74.94,24.45 v74.94,23.81 | J12.17 75.57,40 v75.57,42.54
  Bottom 0.305: J12.17 74.3,27.94 73.67,27.31 73.67,25.08 v74.94,23.81
E1_VREF  (via drill 0.4)
  Top 0.305: v79.07,14.61 78.5,15.17 IC4.12 IC4.13
  Bottom 0.279: J12.19 76.84,34.61 82.24,29.21 VR4.S
  Bottom 0.406: v79.07,14.61 83.19,14.61 84.46,15.88 VR4.S
E2_DIR  (via drill 0.4)
  Top 0.279: IC7.20 96.87,24.74 94.94,26.67 94.94,27.62 94.31,28.26 94.31,30.48 92.4,32.38 v87.16,32.38
  Bottom 0.279: J12.21 79.38,33.97 80.97,32.38 v87.16,32.38
E2_STEP
  Top 0.279: IC7.22 95.57,24.14 93.67,26.04 93.67,26.99 93.04,27.62 93.04,29.53 91.77,30.8 86.05,30.8 84.78,32.07 84.78,34.61 83.51,35.88 79.7,35.88 78.11,37.46 78.11,40 J12.22
  Bottom 0.279: J11.9 81.29,37.46 80.65,38.1 80.65,40 J12.22
E2_VREF  (via drill 0.4)
  Top 0.279: J12.24 83.83,39.37 83.83,38.1 87,34.92 89.86,34.92 91.13,33.66 92.72,33.66 93.51,32.86 v101.13,32.86
  Top 0.305: v99.39,14.61 98.82,15.17 IC7.12 IC7.13
  Bottom 0.279: v101.13,32.86 VR6.S
  Bottom 0.406: v99.39,14.61 103.51,14.61 104.78,15.88 VR6.S
GND  (via drill 0.4)
  Top 0.279: IC7.28 91.67,20.25 v91.58,20.16
  other vias: 20.33,19.05 20.33,17.94 20.33,20.16 8.9,19.05 8.9,20.16 8.9,21.27 8.9,17.94 8.9,16.83 20.33,21.27 20.33,16.83 29.22,16.83 29.22,17.94 29.22,20.16 29.22,21.27 29.22,19.05 101.61,16.83 101.61,17.94 101.61,19.05 101.61,20.16 101.61,21.27 90.18,19.05 90.18,17.94 90.18,16.83 81.29,16.83 81.29,17.94 81.29,21.27 81.29,20.16 81.29,19.05 60.97,21.27 40.65,16.83 49.54,16.83 69.86,16.83 60.97,16.83 60.97,17.94 69.86,17.94 69.86,19.05 69.86,20.16 60.97,20.16 60.97,19.05 40.65,17.94 49.54,20.16 49.54,19.05 49.54,17.94 10.33,20.16 10.33,17.94 18.9,20.16 18.9,17.94 30.65,20.16 30.65,17.94 39.22,20.16 39.22,17.94 50.97,20.16 50.97,17.94 59.54,20.16 59.54,17.94 15.88,31.12 71.26,20.16 71.26,19.05 71.26,17.94 72.4,17.94 72.4,19.05 72.4,20.16 78.75,20.16 79.89,20.16 79.89,19.05 78.75,19.05 78.75,17.94 79.89,17.94 92.72,20.16 92.72,19.05 92.72,17.94 99.07,19.05 99.07,20.16 99.07,17.94 100.21,19.05 100.21,17.94 100.21,20.16 91.58,19.05 91.58,17.94 50.97,19.05 52.08,19.05 52.08,20.16 52.08,17.94 58.43,19.05 58.43,20.16 59.54,19.05 58.43,17.94 31.76,19.05 31.76,17.94 31.76,20.16 30.65,19.05 38.11,19.05 38.11,20.16 39.22,19.05 38.11,17.94 17.79,19.05 17.79,20.16 18.9,19.05 17.79,17.94 11.44,19.05 11.44,20.16 10.33,19.05 11.44,17.94 102.09,38.42 102.09,37.15 106.21,37.15 106.21,38.42 34.93,26.67 75.57,35.88 90.18,33.34
  pour Bottom: -0.63,60.96 111.77,60.96 111.77,-0.64 -0.63,-0.64
  pour Top: -0.63,60.96 111.77,60.96 111.77,-0.64 -0.63,-0.64
N$1  (via drill 0.4)
  other vias: 10.8,8.89
N$2
  Bottom 1.778: 19.06,40 22.23,40 26.04,40
N$3
  Top 0.305: IC1.5 12.99,15.13
  Top 0.406: 12.99,15.13 12.99,11.39 10.8,9.21 10.8,8.89
  Top 0.813: 10.8,8.89 J1.4
  Bottom 0.813: J1.4 10.8,8.89
N$4  (via drill 0.4)
  other vias: 18.42,8.89
N$5  (via drill 0.4)
  Top 0.305: IC4.10 77.2,15.29
  Top 0.406: 77.2,15.29 77.2,11.39 79.38,9.21 v79.38,8.97
  Top 0.813: J14.1 v79.38,8.97
  Bottom 0.813: 79.38,7.62 J14.1 v79.38,8.97
N$6  (via drill 0.4)
  Top 0.279: IC3.10 56.88,15.29
  Top 0.406: 56.88,15.29 56.88,11.39 59.06,9.21 v59.06,8.97
  Top 0.813: J13.1 v59.06,8.97
  Bottom 0.813: v59.06,8.97 J13.1
N$7  (via drill 0.4)
  Top 0.305: IC7.10 97.52,15.29
  Top 0.406: 97.52,15.29 97.52,11.39 99.7,9.21 v99.7,8.97
  Top 0.813: J24.1 v99.7,8.97
  Bottom 0.813: v99.7,8.97 J24.1
N$8  (via drill 0.4)
  Top 0.305: IC7.7 95.57,15.29
  Top 0.406: v94.62,8.89 95.57,9.83 95.57,15.29
  Top 0.813: v94.62,8.89 J24.3
  Bottom 0.813: J24.3 v94.62,8.89
N$9
  Top 0.279: 22.23,23.81 22.23,30.77 R1.1
  Top 0.305: IC1.15 18.84,22.96 19.22,23.34 21.76,23.34 22.23,23.81
  Top 0.406: R1.1 C7.1
N$10
  Top 1.778: F1.2 F1.1 19.35,50.45
  Bottom 0.279: F1.1 19.37,40.01 19.38,40
  Bottom 1.778: F1.1 | 19.35,48.6 J23.1 19.35,48.89 19.35,40.29 19.38,40
N$11
  Top 0.279: R14.2 83.54,34.42 83.99,33.97 83.99,31.75 86.98,28.76 VR4.E
N$12
  Top 0.279: C8.1 IC2.15 39.64,21.85 39.82,22.03 R2.1
N$13
  Top 0.279: 79.8,25.16 79.8,30.9 81.03,32.13 C16.1
  Top 0.305: IC4.15 79.8,25.16
  Top 0.406: C16.1 R14.1
N$14
  Top 0.279: IC7.15 100.12,22.96 100.66,23.5 103.2,23.5 103.83,24.13 103.83,27.62 103.51,27.94 103.51,31.91 104.28,32.67 C26.1
  Top 0.406: C26.1 R29.1
N$15
  Bottom 1.778: 34.93,40 38.74,40 41.6,40 41.6,39.85
N$16  (via drill 0.4)
  Top 0.406: R2.2 v40.65,19.37 | v41.28,24.13 43.8,24.13 VR2.E
  Bottom 0.279: v40.65,19.37 40.65,23.5 v41.28,24.13
N$17
  Top 0.406: R29.2 VR6.E
N$18
  Top 0.406: VR1.E 26.02,30.82 25.57,31.27 R1.2
N$19
  Top 0.279: IC5.6 99.7,41.59 98.43,40.32 IC5.2 C18.1 R25.1
N$20
  Top 0.279: IC3.15 59.48,22.96 60.02,23.5 64.78,23.5 65.41,24.13 R13.1
  Top 0.406: C15.1 R13.1
N$21
  Top 0.279: C21.1 R28.1 | IC6.2 R28.1 | R26.1 R28.1
N$22
  Top 0.406: R13.2 66.94,30.1 66.68,29.85 66.68,26.7 VR3.E
N$23  (via drill 0.4)
  Top 0.279: C17.1 100.69,35.69 v101.32,35.05
  Top 0.406: v100.97,40 IC5.5
  Bottom 0.279: v101.32,35.05 101.32,36.48 100.97,36.83 v100.97,40
N$24
  Top 0.406: LED9.A R27.1
N$26
  Top 0.279: IC5.7 98.43,41.91 95.58,39.05 95.58,34.61 96.02,34.16 R25.2
  Top 0.406: IC5.7 98.43,47.31 99.07,47.94 VR5.A 105.42,50.46 VR5.S
N$28  (via drill 0.4)
  Top 0.305: IC1.7 14.29,15.13
  Top 0.406: v13.34,8.89 14.29,9.83 14.29,15.13
  Top 0.813: v13.34,8.89 J1.3
  Bottom 0.813: J1.3 v13.34,8.89
N$29
  Top 0.305: IC1.10 16.24,15.13
  Top 0.406: 18.42,9.21 16.24,11.39 16.24,15.13
  Top 0.813: 18.42,9.21 J1.1
  Bottom 0.813: J1.1 18.42,8.89
N$35  (via drill 0.4)
  Top 0.305: IC1.8 14.94,15.13
  Top 0.406: v15.88,8.89 14.94,9.83 14.94,15.13
  Top 0.813: v15.88,8.89 J1.2
  Bottom 0.813: J1.2 v15.88,8.89
N$36
  Top 0.305: IC1.1 10.39,15.14 10.17,14.92 9.06,14.92 8.77,14.64 C1.2
N$52
  Top 0.305: IC1.2 11.04,14.71 C1.1
N$54
  Top 0.279: IC1.19 16.24,24.57 15.41,25.4 15.41,29.37 18.11,32.07 J9.2
N$57
  Top 0.305: IC1.3 11.69,13.78 C2.2
N$59  (via drill 0.4)
  Top 0.305: IC1.6 13.64,15.13
  Top 0.406: v12.71,9.84 13.64,10.77 13.64,15.13
  Top 0.813: 6.36,17.15 R6.1 6.36,11.11 7.63,9.84 v9.85,9.84
  Bottom 0.406: v12.71,9.84 v9.85,9.84
N$60  (via drill 0.4)
  Top 0.279: IC3.5 53.63,15.29
  Top 0.406: 53.63,15.29 53.63,11.39 51.44,9.21 v51.44,8.97
  Top 0.813: v51.44,8.97 J13.4
  Bottom 0.813: J13.4 v51.44,8.97
N$61  (via drill 0.4)
  Top 0.305: IC1.9 15.59,15.13
  Top 0.406: v16.52,9.84 15.59,10.77 15.59,15.13
  Top 0.813: v19.06,12.7 22.23,12.7 22.87,13.33 R5.1
  Bottom 0.406: v19.06,12.7 19.06,10.48 18.42,9.84 v16.52,9.84
N$62  (via drill 0.4)
  Top 0.279: IC3.7 54.93,15.29
  Top 0.406: 54.93,15.29 54.93,9.83 v53.98,8.89
  Top 0.813: J13.3 v53.98,8.89
  Bottom 0.813: 53.98,7.62 J13.3 v53.98,8.89
N$65  (via drill 0.4)
  Top 0.279: IC3.8 55.58,15.29
  Top 0.406: 55.58,15.29 55.58,9.83 v56.52,8.89
  Top 0.813: J13.2 v56.52,8.89
  Bottom 0.813: 56.52,7.46 J13.2 v56.52,8.89
N$67
  Top 0.279: 16.89,22.98 16.89,25.03 16.68,25.24 LED2.C
  Top 0.305: IC1.18 16.89,22.98
N$68
  Top 0.279: IC1.27 11.04,22.78 10.64,23.18 5.88,23.18 5.41,23.65 5.41,30.64
  Top 0.305: 5.41,30.64 5.41,31.24 LED1.C
N$69
  Top 0.406: R9.1 LED1.A
N$70
  Top 0.406: LED2.A 16.68,28.73 R10.1
N$71
  Top 0.279: IC1.25 12.34,23.39 10.17,25.56 10.17,26.67 9.53,27.31 J4.2
N$72
  Top 0.279: IC1.26 11.69,23.09 10.01,24.77 J5.2
N$73
  Top 0.305: IC1.24 12.99,23.69 11.44,25.24 11.44,27.94 9.53,29.85 J3.2
N$74
  Top 0.305: IC3.3 52.33,13.78 C10.2
N$75  (via drill 0.4)
  Top 0.279: IC3.6 54.28,15.29
  Top 0.406: 54.28,15.29 54.28,10.77 v53.35,9.84
  Top 0.813: v50.49,9.84 49.22,9.84 47,12.06 R18.1
  Bottom 0.33: v50.49,9.84 v53.35,9.84
N$76  (via drill 0.4)
  Top 0.279: IC3.9 56.23,15.29
  Top 0.406: 56.23,15.29 56.23,10.77 v57.16,9.84
  Top 0.813: R17.1 63.51,13.33 62.87,12.7 v59.7,12.7
  Bottom 0.406: v57.16,9.84 59.06,9.84 59.7,10.48 v59.7,12.7
N$78
  Top 0.279: IC3.18 57.53,23.23 57.79,23.5 LED6.C
N$79  (via drill 0.4)
  Top 0.279: IC3.27 51.68,22.94 51.44,23.18 50.49,23.18 v50.17,22.86
  Top 0.406: LED5.C 52.59,28.7 v52.08,29.21
  Bottom 0.279: v52.08,29.21 52.08,26.67 50.17,24.77 v50.17,22.86
N$80
  Top 0.406: LED5.A R21.1
N$81
  Top 0.406: LED6.A R22.1
N$82
  Top 0.305: IC3.1 51.03,15.3 50.81,15.08 49.86,15.08 49.41,14.64 C9.2
N$83
  Top 0.305: IC3.2 51.68,14.71 C9.1
N$84  (via drill 0.4)
  Top 0.279: J21.2 58.59,31.43 58.27,31.12 v55.89,31.12 | IC3.19 v56.88,23.85
  Bottom 0.279: v56.88,23.85 56.17,23.85 54.62,25.4 54.62,27.94 55.89,29.21 v55.89,31.12
N$85
  Top 0.279: IC3.24 53.63,24.01 52.08,25.56 52.08,26.99 51.28,27.78 51.28,28.89 51,29.18 J15.2
N$86
  Top 0.279: J16.2 51.06,26.89 51.44,26.51 51.44,25.24 52.98,23.71 IC3.25
N$87
  Top 0.279: IC3.26 52.33,23.4 51.13,24.61 J17.2
N$91  (via drill 0.4)
  Top 0.305: IC2.5 33.31,15.13
  Top 0.406: 33.31,15.13 33.31,11.39 31.12,9.21 31.12,9.13 v31.12,8.89
  Top 0.813: v31.12,8.89 J2.4
  Bottom 0.813: 31.12,7.62 J2.4 v31.12,8.89
N$92  (via drill 0.4)
  Top 0.279: 34.61,11.12 34.62,15.13 34.61,14.97
  Top 0.305: IC2.7 34.61,15.29 34.62,15.13
  Top 0.406: 34.62,15.13 34.62,9.84 v33.66,8.89
  Top 0.813: v33.66,8.89 J2.3
  Bottom 0.813: J2.3 v33.66,8.89
N$93  (via drill 0.4)
  Top 0.305: IC2.10 36.56,15.13
  Top 0.406: 36.56,15.13 36.56,11.39 38.74,9.21 v38.74,9.05
  Top 0.813: v38.74,9.05 J2.1
  Bottom 0.813: 38.74,7.62 J2.1 v38.74,9.05
N$94  (via drill 0.4)
  Top 0.305: IC2.8 35.26,15.13
  Top 0.406: v36.2,8.89 35.26,9.83 35.26,15.13
  Top 0.813: v36.2,8.89 J2.2
  Bottom 0.813: 36.2,7.62 J2.2 v36.2,8.89
N$95
  Top 0.305: IC2.3 32.01,13.78 C5.2
N$96  (via drill 0.4)
  Top 0.305: IC2.6 33.96,15.13
  Top 0.406: v33.03,9.84 33.96,10.77 33.96,15.13
  Top 0.813: v30.17,9.84 28.9,9.84 26.68,12.06 R8.1
  Bottom 0.457: v33.03,9.84 v30.17,9.84
N$97  (via drill 0.4)
  Top 0.305: IC2.9 35.91,15.13
  Top 0.406: 35.91,15.13 35.91,10.77 v36.84,9.84
  Top 0.813: v39.38,12.7 42.55,12.7 43.19,13.33 R7.1
  Bottom 0.406: v39.38,12.7 39.38,10.48 38.82,9.92 37.71,9.92 37.63,9.84 v36.84,9.84
N$99
  Top 0.279: IC2.18 37.21,23.92 37,24.13 37,25.08 37.66,25.75 LED4.C
N$100
  Top 0.305: IC2.27 31.36,22.94 30.96,23.34 27.79,23.34 27.31,23.81 27.31,31.12 27.66,31.46 LED3.C
N$101
  Top 0.406: LED3.A R11.1
N$102
  Top 0.406: R12.1 LED4.A
N$105
  Top 0.305: IC2.1 30.71,15.3 30.33,14.92 29.38,14.92 29.09,14.64 C4.2
N$106
  Top 0.305: IC2.2 31.36,14.71 C4.1
N$107
  Top 0.279: J10.2 36.84,27.23 36.2,26.6 36.2,24.13 36.56,23.78 IC2.19
N$108
  Top 0.305: IC2.24 33.31,23.37 32.55,24.13 32.55,28.42 31.12,29.85 J6.2
N$109
  Top 0.305: IC2.25 32.66,23.23 31.92,23.97 31.92,24.77 31.44,25.24 31.44,26.99 31.12,27.31 J7.2
N$110
  Top 0.305: IC2.26 32.01,23.09 31.28,23.81 31.28,24.29 30.81,24.77 J8.2
N$111  (via drill 0.4)
  Top 0.305: IC4.5 73.95,15.29
  Top 0.406: 73.95,15.29 73.95,11.39 71.76,9.21 v71.76,8.97
  Top 0.813: J14.4 v71.76,8.97
  Bottom 0.813: 71.76,7.62 J14.4 v71.76,8.97
N$112  (via drill 0.4)
  Top 0.305: IC4.7 75.25,15.29
  Top 0.406: v74.3,8.89 75.25,9.83 75.25,15.29
  Top 0.813: v74.3,8.89 J14.3
  Bottom 0.813: 74.3,7.62 J14.3 74.3,8.73
N$114  (via drill 0.4)
  Top 0.305: IC4.8 75.9,15.29
  Top 0.406: v76.84,8.89 75.9,9.83 75.9,15.29
  Top 0.813: v76.84,8.89 J14.2
  Bottom 0.813: 76.84,7.62 J14.2 76.84,8.73
N$115
  Top 0.305: IC4.3 72.65,13.78 C13.2
N$116  (via drill 0.4)
  Top 0.305: IC4.6 74.6,15.29
  Top 0.406: 74.6,15.29 74.6,10.77 v73.67,9.84
  Top 0.813: v70.81,9.84 69.54,9.84 67.32,12.06 R20.1
  Bottom 0.406: v73.67,9.84 v70.81,9.84
N$117  (via drill 0.4)
  Top 0.305: IC4.9 76.55,15.29
  Top 0.406: 76.55,15.29 76.55,10.77 v77.48,9.84
  Top 0.813: v80.02,12.7 83.19,12.7 83.83,13.33 R19.1
  Bottom 0.406: v77.48,9.84 79.38,9.84 80.02,10.48 v80.02,12.7
N$119
  Top 0.279: IC4.18 77.85,22.91 78.43,23.5 78.43,27.46 74.81,31.08 LED8.C
N$120  (via drill 0.4)
  Top 0.279: IC4.27 72,22.94 71.76,23.18 70.81,23.18 v70.33,22.7
  Top 0.406: LED7.C v69.1,32.26
  Bottom 0.279: v69.1,32.26 69.1,23.94 v70.33,22.7
N$121
  Top 0.279: R23.1 69.54,33.18 70.62,32.1 LED7.A
N$122
  Top 0.406: LED8.A 76.34,31.15 R24.1
N$123
  Top 0.305: IC4.1 71.35,15.3 70.97,14.92 70.02,14.92 69.73,14.64 C12.2
N$124
  Top 0.305: IC4.2 72,14.71 C12.1
N$125
  Top 0.279: IC4.19 77.2,23.21 77.72,23.73 77.72,26.91 73.67,30.96 73.67,32.38 74.14,32.86 75.26,32.86 75.89,33.5 J22.2
N$126
  Top 0.279: J18.2 71.76,29.21 73.19,27.78 73.19,25.24 73.95,24.49 IC4.24
N$127
  Top 0.279: IC4.25 73.3,23.97 72.4,24.87 72.4,26.35 71.92,26.83 J19.2
N$128
  Top 0.279: IC4.26 72.65,23.4 71.6,24.45 J20.2
N$165  (via drill 0.4)
  Top 0.305: IC7.5 94.27,15.29
  Top 0.406: 94.27,15.29 94.27,11.39 92.08,9.21 v92.08,8.97
  Top 0.813: J24.4 v92.08,8.97
  Bottom 0.813: 92.08,7.46 J24.4 v92.08,8.97
N$168  (via drill 0.4)
  Top 0.305: IC7.8 96.22,15.29
  Top 0.406: v97.16,8.89 96.22,9.83 96.22,15.29
  Top 0.813: v97.16,8.89 J24.2
  Bottom 0.813: 97.16,7.62 J24.2 v97.16,8.89
N$169
  Top 0.305: IC7.3 92.97,13.78 C24.2
N$170  (via drill 0.4)
  Top 0.305: 94.92,10.77 v93.99,9.84 | IC7.6 94.92,15.29
  Top 0.406: 94.92,15.29 94.92,10.77
  Top 0.813: v91.13,9.84 89.86,9.84 87.64,12.06 R32.1
  Bottom 0.305: v93.99,9.84 v91.13,9.84
N$171  (via drill 0.4)
  Top 0.305: IC7.9 96.87,15.29
  Top 0.406: 96.87,15.29 96.87,10.77 v97.8,9.84
  Top 0.813: v100.34,12.7 103.51,12.7 104.15,13.33 R31.1
  Bottom 0.406: v97.8,9.84 99.7,9.84 100.34,10.48 v100.34,12.7
N$173
  Top 0.279: IC7.18 98.17,23.07 98.43,23.34 LED11.C
N$174  (via drill 0.4)
  Top 0.279: IC7.27 92.32,22.94 92.08,23.18 91.05,23.18 90.73,22.86 90.73,21.99 v90.02,21.27 | LED10.C 102.05,25.27 v102.88,24.45
  Bottom 0.279: v90.02,21.27 90.81,22.07 90.81,24.13 91.45,24.77 97.48,24.77 99.07,23.18 102.4,23.18 102.88,23.65 v102.88,24.45
N$175
  Top 0.279: LED10.A 100.18,27.46 100.34,27.62 R33.1
N$176
  Top 0.279: R34.1 97.73,27.5 LED11.A
N$177
  Top 0.305: IC7.1 91.67,15.3 91.29,14.92 90.34,14.92 90.05,14.64 C23.2
N$178
  Top 0.305: IC7.2 92.32,14.71 C23.1
N$179
  Top 0.279: IC7.19 97.52,25.05 95.58,26.99 95.58,27.94 94.94,28.58 94.94,29.53 95.26,29.85 96.85,29.85 97.16,30.16 J28.2
N$180
  Top 0.279: IC7.24 94.27,24.49 93.04,25.72 93.04,26.67 92.4,27.31 92.4,28.89 92.08,29.21 J25.2
N$181
  Top 0.279: J26.2 91.92,26.83 92.4,26.35 92.4,25.24 93.62,24.02 IC7.25
N$182
  Top 0.279: IC7.26 92.97,23.56 92.08,24.45 J27.2
STEP_TEST  (via drill 0.4)
  Top 0.279: IC5.3 v99.7,40
  Top 0.406: v94.94,40 J11.8 | J11.10 J11.8 | J11.2 J11.4 J11.6 J11.8
  Bottom 0.279: v99.7,40 v94.94,40
X_DIR  (via drill 0.4)
  Top 0.279: IC1.20 15.59,24.27 14.77,25.08 v14.77,31.12
  Top 0.305: v41.12,34.45 49.7,34.45 J12.1
  Bottom 0.279: v14.77,31.12 14.77,33.66 15.57,34.45 37,34.45
  Bottom 0.305: 36.68,34.45 37,34.45 v41.12,34.45
X_STEP
  Top 0.254: 42.24,35.24 39.06,35.24
  Top 0.279: J11.1 87.64,47.62 87,46.99 74.3,46.99 73.03,45.72 67.32,45.72 66.05,44.45 63.51,44.45 62.24,43.18 55.89,43.18 J12.2
  Top 0.305: IC1.22 14.29,23.5 12.71,25.08 12.71,34.29 13.66,35.24 39.06,35.24 | J12.2 47.95,35.24 42.24,35.24
X_VREF  (via drill 0.4)
  Top 0.279: IC1.13 IC1.12 17.54,15.17 v18.11,14.61
  Top 0.305: v42.55,32.86 51.92,32.86 55.89,36.83 56.52,36.83 57.79,38.1 57.79,40 J12.4
  Bottom 0.279: 28.58,32.38 26.68,32.38 VR1.S
  Bottom 0.305: 28.58,32.38 41.28,32.38 41.76,32.86 v42.55,32.86
  Bottom 0.406: v18.11,14.61 22.23,14.61 23.5,15.88 VR1.S
Y_DIR  (via drill 0.4)
  Top 0.305: IC2.20 35.91,23.47 34.77,24.61 v34.77,25.4 | v42.55,30.48 52.71,30.48 56.84,34.61 57.95,34.61 58.59,35.24 v60.33,35.24
  Bottom 0.305: v34.77,25.4 37.47,25.4 v42.55,30.48 | v60.33,35.24 60.33,40 J12.6
Y_STEP  (via drill 0.4)
  Top 0.254: 41.28,32.07 43.51,32.07
  Top 0.279: J11.3 85.1,45.09 84.46,45.72 74.94,45.72 73.67,44.45 67.95,44.45 66.68,43.18 v64.14,43.18
  Top 0.305: IC2.22 34.61,22.87 33.35,24.13 33.35,32.07 34.62,33.34 40.01,33.34 41.28,32.07 | J12.7 59.7,36.83 57.79,36.83 57,36.04 56.36,36.04 52.4,32.07 43.51,32.07
  Bottom 0.279: J12.7 62.87,40 62.87,41.91 v64.14,43.18
Y_VREF  (via drill 0.4)
  Top 0.305: v38.43,14.61 37.86,15.17 IC2.12 IC2.13 | v40.01,36.2 v45.73,36.2
  Bottom 0.305: v40.01,36.2 40.81,36.2 43.82,33.18 VR2.S | v45.73,36.2 57.79,36.2 59.7,34.29 60.97,34.29 64.14,37.46 J12.9
  Bottom 0.406: v38.43,14.61 42.55,14.61 43.82,15.88 VR2.S
Z_DIR  (via drill 0.4)
  Top 0.229: 56.23,23 56.05,23.18 56.05,24.84 56.52,25.32
  Top 0.279: 56.52,25.32 56.52,28.42 57.16,29.05 v59.7,29.05 | IC3.20 56.23,23
  Bottom 0.279: v59.7,29.05 62.56,31.91 62.56,33.34 66.68,37.46 J12.11
Z_STEP  (via drill 0.4)
  Top 0.279: IC3.22 54.93,23.98 v52.95,25.96 | J11.5 85.1,42.54 83.19,44.45 75.57,44.45 74.3,43.18 68.59,43.18 J12.12
  Bottom 0.279: v52.95,25.96 52.95,32.62 53.98,33.66 61.6,33.66 65.41,37.46
  Bottom 0.305: 65.41,37.46 65.41,40 J12.12
Z_VREF  (via drill 0.4)
  Top 0.279: v58.75,14.61 58.18,15.17 IC3.12 IC3.13
  Top 0.406: VR3.S v64.14,24.45
  Bottom 0.279: VR3.S 64.14,33.66 67.95,37.46 67.95,40 J12.14
  Bottom 0.406: v58.75,14.61 62.87,14.61 64.14,15.88 v64.14,24.45

### Text on the board
tPlace: 5-channel DRV8825 Stepper Driver Module | VIN | GND | MAX 40V | Luke Weston, 2013 | + | - | Stepper | Test | Test | Speed | X | X | Y | Y | M205 Fuse | Z | Z | E1 | E1 | + | E2 | E2 | X Decay: | SD | FD | Y Home | Y Decay: | 1 | SD | FD | E2 | X / Home | SD | FD | Z Decay: | Decay: SD | FD | Home | SD | FD | Y Current | Fault | E1 Current | E2 / Current | M0 | M0 | Z Home | M0 | M0 | M0 | M1 | X | M1 | M1 | M1 | M1 | E1 | E2 | M2 | X Fault | Y / Fault | M2 | M2 | Z Fault | M2 | M2 | Fault | Home | X | Y | Z | E1 | E2